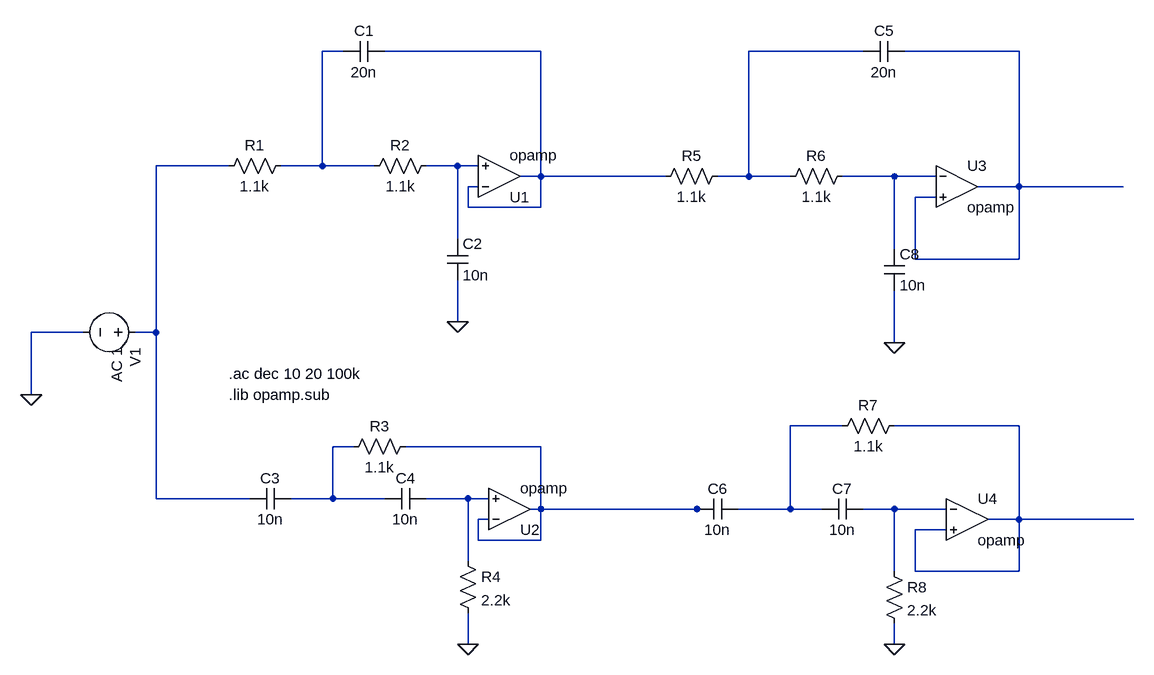
[diagram p0: schematic LTspice_LR4_tb.asc]
LTspice_LR4_tb.asc, the LTspice schematic file:
Version 4.1
SHEET 1 948 680
WIRE -272 -1008 -304 -1008
WIRE 32 -1008 -208 -1008
WIRE 528 -1008 352 -1008
WIRE 768 -1008 592 -1008
WIRE -448 -832 -560 -832
WIRE -304 -832 -304 -1008
WIRE -304 -832 -368 -832
WIRE -224 -832 -304 -832
WIRE -96 -832 -144 -832
WIRE -64 -832 -96 -832
WIRE 32 -816 32 -1008
WIRE 32 -816 0 -816
WIRE 224 -816 32 -816
WIRE 352 -816 352 -1008
WIRE 352 -816 304 -816
WIRE 416 -816 352 -816
WIRE 576 -816 496 -816
WIRE 640 -816 576 -816
WIRE -64 -800 -80 -800
WIRE 768 -800 768 -1008
WIRE 768 -800 704 -800
WIRE 928 -800 768 -800
WIRE 640 -784 608 -784
WIRE -80 -768 -80 -800
WIRE 32 -768 32 -816
WIRE 32 -768 -80 -768
WIRE -96 -720 -96 -832
WIRE 576 -704 576 -816
WIRE 608 -688 608 -784
WIRE 768 -688 768 -800
WIRE 768 -688 608 -688
WIRE -96 -592 -96 -656
WIRE -672 -576 -752 -576
WIRE -560 -576 -560 -832
WIRE -560 -576 -592 -576
WIRE 576 -560 576 -640
WIRE -752 -480 -752 -576
WIRE -736 -480 -752 -480
WIRE 496 -432 416 -432
WIRE 768 -432 576 -432
WIRE -256 -400 -288 -400
WIRE 32 -400 -176 -400
WIRE -560 -320 -560 -576
WIRE -416 -320 -560 -320
WIRE -288 -320 -288 -400
WIRE -288 -320 -352 -320
WIRE -208 -320 -288 -320
WIRE -80 -320 -144 -320
WIRE -48 -320 -80 -320
WIRE 32 -304 32 -400
WIRE 32 -304 16 -304
WIRE 272 -304 32 -304
WIRE 288 -304 272 -304
WIRE 416 -304 416 -432
WIRE 416 -304 336 -304
WIRE 464 -304 416 -304
WIRE 576 -304 528 -304
WIRE 656 -304 576 -304
WIRE -48 -288 -64 -288
WIRE 768 -288 768 -432
WIRE 768 -288 720 -288
WIRE 944 -288 768 -288
WIRE 656 -272 608 -272
WIRE -64 -256 -64 -288
WIRE 32 -256 32 -304
WIRE 32 -256 -64 -256
WIRE -80 -224 -80 -320
WIRE 576 -208 576 -304
WIRE 608 -208 608 -272
WIRE 768 -208 768 -288
WIRE 768 -208 608 -208
WIRE -80 -96 -80 -144
WIRE 576 -96 576 -128
FLAG -96 -592 0
FLAG -80 -96 0
FLAG -752 -480 0
FLAG 576 -96 0
FLAG 576 -560 0
SYMBOL OpAmps\\opamp -32 -752 M180
SYMATTR InstName U1
SYMBOL OpAmps\\opamp -16 -240 M180
SYMATTR InstName U2
SYMBOL res -352 -848 R90
WINDOW 0 0 56 VBottom 2
WINDOW 3 32 56 VTop 2
SYMATTR InstName R1
SYMATTR Value 1.1k
SYMBOL cap -208 -1024 R90
WINDOW 0 0 32 VBottom 2
WINDOW 3 32 32 VTop 2
SYMATTR InstName C1
SYMATTR Value 20n
SYMBOL voltage -576 -576 R90
WINDOW 123 24 44 Left 2
WINDOW 39 0 0 Left 0
SYMATTR Value2 AC 1
SYMATTR InstName V1
SYMATTR Value ""
SYMBOL res -128 -848 R90
WINDOW 0 0 56 VBottom 2
WINDOW 3 32 56 VTop 2
SYMATTR InstName R2
SYMATTR Value 1.1k
SYMBOL cap -112 -720 R0
SYMATTR InstName C2
SYMATTR Value 10n
SYMBOL res -160 -416 R90
WINDOW 0 0 56 VBottom 2
WINDOW 3 32 56 VTop 2
SYMATTR InstName R3
SYMATTR Value 1.1k
SYMBOL cap -352 -336 R90
WINDOW 0 0 32 VBottom 2
WINDOW 3 32 32 VTop 2
SYMATTR InstName C3
SYMATTR Value 10n
SYMBOL cap -144 -336 R90
WINDOW 0 0 32 VBottom 2
WINDOW 3 32 32 VTop 2
SYMATTR InstName C4
SYMATTR Value 10n
SYMBOL res -96 -240 R0
SYMATTR InstName R4
SYMATTR Value 2.2k
SYMBOL OpAmps\\opamp 672 -864 R0
SYMATTR InstName U3
SYMBOL OpAmps\\opamp 688 -352 R0
SYMATTR InstName U4
SYMBOL res 320 -832 R90
WINDOW 0 0 56 VBottom 2
WINDOW 3 32 56 VTop 2
SYMATTR InstName R5
SYMATTR Value 1.1k
SYMBOL res 512 -832 R90
WINDOW 0 0 56 VBottom 2
WINDOW 3 32 56 VTop 2
SYMATTR InstName R6
SYMATTR Value 1.1k
SYMBOL res 592 -448 R90
WINDOW 0 0 56 VBottom 2
WINDOW 3 32 56 VTop 2
SYMATTR InstName R7
SYMATTR Value 1.1k
SYMBOL cap 592 -1024 R90
WINDOW 0 0 32 VBottom 2
WINDOW 3 32 32 VTop 2
SYMATTR InstName C5
SYMATTR Value 20n
SYMBOL cap 336 -320 R90
WINDOW 0 0 32 VBottom 2
WINDOW 3 32 32 VTop 2
SYMATTR InstName C6
SYMATTR Value 10n
SYMBOL cap 528 -320 R90
WINDOW 0 0 32 VBottom 2
WINDOW 3 32 32 VTop 2
SYMATTR InstName C7
SYMATTR Value 10n
SYMBOL cap 560 -704 R0
SYMATTR InstName C8
SYMATTR Value 10n
SYMBOL res 560 -224 R0
SYMATTR InstName R8
SYMATTR Value 2.2k
TEXT -448 -512 Left 2 !.ac dec 10 20 100k
TEXT -448 -480 Left 2 !.lib opamp.sub

The netlist it stands for:
* LTspice_LR4_tb.asc
X§U1 N002 N006 N002 opamp Aol=100K GBW=10Meg  ; pins invin noninvin out
X§U2 N011 N012 N011 opamp Aol=100K GBW=10Meg  ; pins invin noninvin out
R1 N001 N005 1.1k
C1 N002 N001 20n
V1 N005 0 AC 1
R2 N006 N001 1.1k
C2 N006 0 10n
R3 N011 N010 1.1k
C3 N010 N005 10n
C4 N012 N010 10n
R4 N012 0 2.2k
X§U3 N007 N004 N004 opamp Aol=100K GBW=10Meg  ; pins invin noninvin out
X§U4 N013 N009 N009 opamp Aol=100K GBW=10Meg  ; pins invin noninvin out
R5 N003 N002 1.1k
R6 N007 N003 1.1k
R7 N009 N008 1.1k
C5 N004 N003 20n
C6 N008 N011 10n
C7 N013 N008 10n
C8 N007 0 10n
R8 N013 0 2.2k
.ac dec 10 20 100k
.lib opamp.sub
.backanno
.end